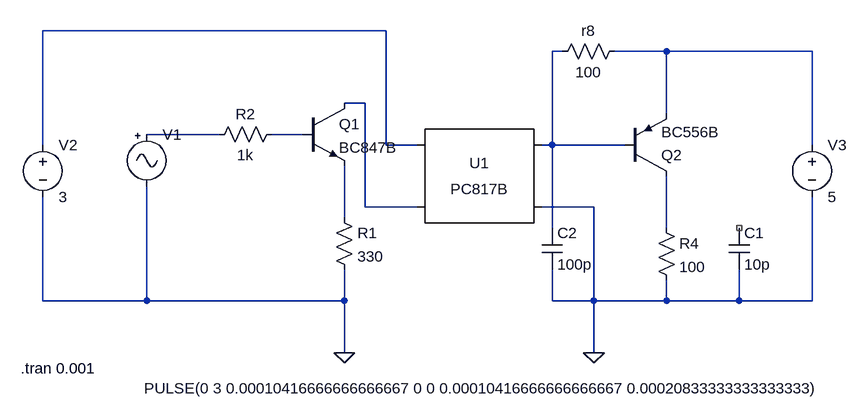
[diagram p0: schematic CurrentNonInvertingFast.asc]
CurrentNonInvertingFast.asc, the LTspice schematic file:
Version 4
SHEET 1 1000 680
WIRE 48 -240 -480 -240
WIRE 320 -208 304 -208
WIRE 480 -208 400 -208
WIRE 704 -208 480 -208
WIRE 16 -128 -16 -128
WIRE 480 -112 480 -208
WIRE -208 -80 -320 -80
WIRE -80 -80 -128 -80
WIRE -480 -64 -480 -240
WIRE 48 -64 48 -240
WIRE 96 -64 48 -64
WIRE 304 -64 304 -208
WIRE 304 -64 288 -64
WIRE 416 -64 304 -64
WIRE 704 -64 704 -208
WIRE 16 32 16 -128
WIRE 96 32 16 32
WIRE 368 32 288 32
WIRE -16 48 -16 -32
WIRE 304 64 304 -64
WIRE 480 64 480 -16
WIRE -480 176 -480 16
WIRE -320 176 -320 0
WIRE -320 176 -480 176
WIRE -16 176 -16 128
WIRE -16 176 -320 176
WIRE 304 176 304 128
WIRE 368 176 368 32
WIRE 368 176 304 176
WIRE 480 176 480 144
WIRE 480 176 368 176
WIRE 592 176 592 128
WIRE 592 176 480 176
WIRE 704 176 704 16
WIRE 704 176 592 176
WIRE -16 256 -16 176
WIRE 368 256 368 176
FLAG -16 256 0
FLAG 368 256 0
SYMBOL res -32 32 R0
SYMATTR InstName R1
SYMATTR Value 330
SYMBOL res -112 -96 R90
WINDOW 0 0 56 VBottom 2
WINDOW 3 32 56 VTop 2
SYMATTR InstName R2
SYMATTR Value 1k
SYMBOL res 416 -224 R90
WINDOW 0 0 56 VBottom 2
WINDOW 3 32 56 VTop 2
SYMATTR InstName r8
SYMATTR Value 100
SYMBOL res 464 48 R0
SYMATTR InstName R4
SYMATTR Value 100
SYMBOL Optos\\PC817B 192 -16 R0
SYMATTR InstName U1
SYMBOL npn -80 -128 R0
SYMATTR InstName Q1
SYMATTR Value BC847B
SYMBOL Misc\\signal -320 -96 R0
WINDOW 3 -4 407 Left 2
WINDOW 123 0 0 Left 2
WINDOW 39 0 0 Left 2
SYMATTR InstName V1
SYMATTR Value PULSE(0 3 0.00010416666666666667 0 0 0.00010416666666666667 0.00020833333333333333)
SYMBOL voltage -480 -80 R0
WINDOW 123 0 0 Left 2
WINDOW 39 0 0 Left 2
SYMATTR InstName V2
SYMATTR Value 3
SYMBOL voltage 704 -80 R0
WINDOW 123 0 0 Left 2
WINDOW 39 0 0 Left 2
SYMATTR InstName V3
SYMATTR Value 5
SYMBOL cap 576 64 R0
SYMATTR InstName C1
SYMATTR Value 10p
SYMBOL cap 288 64 R0
SYMATTR InstName C2
SYMATTR Value 100p
SYMBOL pnp 416 -16 M180
SYMATTR InstName Q2
SYMATTR Value BC556B
TEXT -514 280 Left 2 !.tran 0.001

The netlist it stands for:
* CurrentNonInvertingFast.asc
R1 N007 0 330
R2 N006 N005 1k
r8 N003 N002 100
R4 N008 0 100
XU1 N001 N004 N002 0 PC817 Igain=1.5m
Q1 N004 N006 N007 0 BC847B
V1 N005 0 PULSE(0 3 0.00010416666666666667 0 0 0.00010416666666666667 0.00020833333333333333)
V2 N001 0 3
V3 N003 0 5
C1 NC_01 0 10p
C2 N002 0 100p
Q2 N008 N002 N003 0 BC556B
.model NPN NPN
.model PNP PNP
.lib standard.bjt
.tran 0.001
.lib PC817.sub
.backanno
.end